# Altium schematic sheet MRAM_MR25H40.SchDoc
size 420 x 297 mm; SheetNumber: 9; SheetTotal: 13
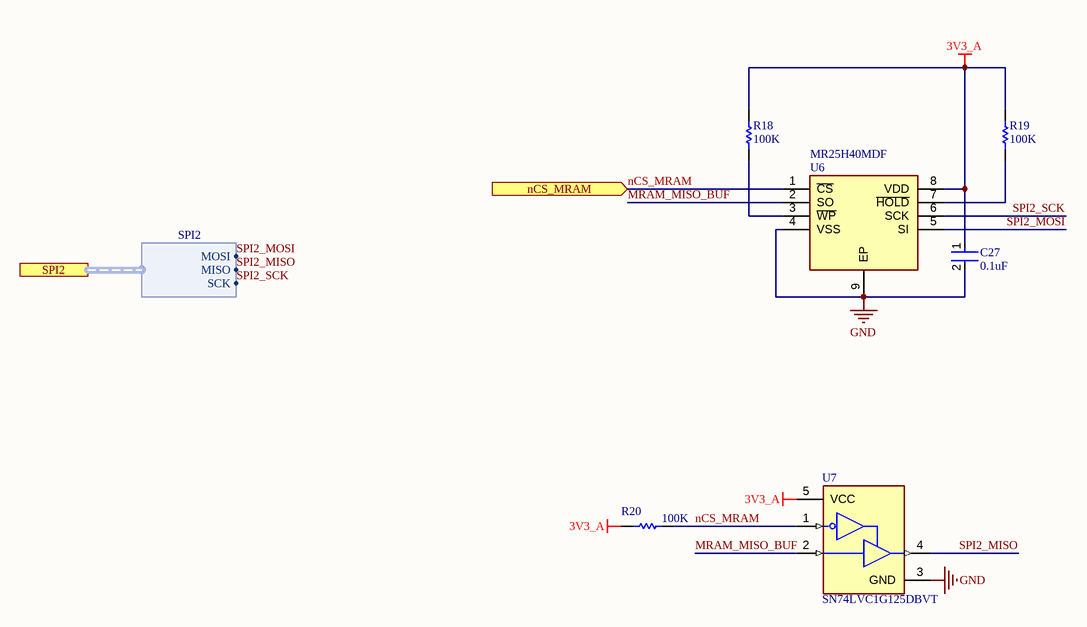
[diagram p0: MRAM_MR25H40.SchDoc]

## Parts
C27  0.1uF  [FP-C0603C-CF-MFG]
R18  100K  [RESC1608X55X30ML20T10]
R19  100K  [RESC1608X55X30ML20T10]
R20  100K  [RESC1608X55X30ML20T10]
U6  MR25H40MDF  [SON127P600X500X90-9N-D]
U7  SN74LVC1G125DBVT  [FP-DBV0005A-MFG]

## Ports
nCS_MRAM (in), SPI2 (harness SPI2)

## Harnesses
SPI2: MOSI, MISO, SCK

## Nets
3V3_A: C27.1 R18.1 R19.1 R20.2 U6.8(VDD) U7.5(VCC)
GND: C27.2 U6.4(VSS) U6.9(EP) U7.3(GND)
MRAM_MISO_BUF: U6.2(SO) U7.2(A)
nCS_MRAM: R20.1 U6.1(~{CS}) U7.1(~{OE}) ; port nCS_MRAM
SPI2_MISO: U7.4(Y) ; port SPI2.MISO
SPI2_MOSI: U6.5(SI) ; port SPI2.MOSI
SPI2_SCK: U6.6(SCK) ; port SPI2.SCK
NetR18_2: R18.2 U6.3(~{WP})
NetR19_2: R19.2 U6.7(~{HOLD})

## Notes on the sheet
- THIS DOCUMENT AND THE DATA DISCLOSED HEREIN OR
- HEREWITH IS THE PROPERTY OF ALTIUM LIMITED AND MAY
- DWG NO:
- REVISION
- REV:
- DESCRIPTION
- DATE
- APPROVED
- BE FREELY DISTRIBUTED IN WHOLE. NO RIGHTS ARE
- RESERVED OR EXPRESS OR IMPLIED WARANTEE GIVEN.
- ENG:
- APPROVALS
- PROJECT
- DSN:
- CHK:
- REFERENCE DOCUMENTS
- PROJECT REVISION:
- TITLE
- DOCUMENT REVISION:
- DESIGN ITEM:
- BOM:
- FAB DWG:
- PCB DWG:
- ASSY DWG:
- SCALE:
- A3
- SIZE
- CAGE CODE
- FILE NAME
- DWG NO.
- SHEET
- OF
- REV

## Library data of the parts
C27 = CMP-2006-03061-2: CAP CER 0.1UF 50V X7R 0603; Manufacturer: KEMET; Manufacturer Part Number: C0603C104K5RACTU; Tolerance: 0.1; Temperature Coefficient: 30ppm/°C; Material: Ceramic; Automotive Grade: Grade 1; Value: 0.10 μF; Temperature: -55°C to +125°C; RoHS: TRUE; Temperature Range High: +125°C; Lead Free: Yes; Octopart: https://octopart.com/c0603c104k5ractu-kemet-139244; Digikey Description: CAP CER 0.1UF 50V X7R 0603; Category: Cap; Package: C0603C-CF; ComponentLink2Description: Datasheet; Temperature Range Low: -55°C; Device Class L1: Passive Components; Voltage Rating: 50 V; Automotive: Yes; Device Class L3: Ceramic Capacitors; ComponentLink2URL: https://api.kemet.com/component-edge/download/datasheet/C0603C100J5GACAUTO.pdf; Capacitance: 0.10 μF; Device Class L2: Capacitors; Temperature Characteristic: X7R; Height: 0.87mm
R18-R20 = CMP-2000-01852-1: Part Number: RK73B1JTTD104J; Manufacturer: KOA Speer
U6 = MR25H40MDF: Integrated Circuit; Manufacturer_Name: Everspin Technologies; Datasheet Link: https://datasheet.datasheetarchive.com/originals/distributors/Datasheets-DGA23/1514724.pdf; Height: 0.9mm; Manufacturer_Part_Number: MR25H40MDF; Mouser Part Number: 936-MR25H40MDF; Mouser Price/Stock: https://www.mouser.co.uk/ProductDetail/Everspin-Technologies/MR25H40MDF?qs=laR3Dyet2Vc5UBOlfE70WA%3D%3D; Arrow Part Number: MR25H40MDF; Arrow Price/Stock: https://www.arrow.com/en/products/mr25h40mdf/everspin-technologies?utm_currency=USD&region=europe
U7 = CMP-0859-00018-4: IC BUF NON-INVERT 5.5V SOT23-5; Manufacturer: Texas Instruments; Min Supply Voltage: 1.65V; Number Of Outputs: 1; Propagation Delay: 4.2ns; Logic Function Desc: Non-Inverting; Nominal Supply Current: 10uA; Standoff Height: 0mm; ComponentLink2Description: Datasheet; Temperature Range High: +125°C; Octopart: https://octopart.com/sn74lvc1g125dbvt-texas+instruments-1006799; Ambient Temperature Range Low: -40°C; Temperature: -40°C to +125°C; Mouser Description: Buffers & Line Drivers SNGL Bus Buffer Gate; Automotive: No; RoHS: TRUE; Device Class L2: Logic ICs; Ambient Temperature Range High: +125°C; ComponentLink2URL: http://www.ti.com/lit/ds/symlink/sn74lvc1g125.pdf; Height: 1.45mm; Number Of Circuits: 1; Device Class L1: Integrated Circuits (ICs); Max Supply Voltage: 5.5V; Manufacturer Part Number: SN74LVC1G125DBVT; Temperature Range Low: -40°C; Package: DBV0005A; Device Class L3: Logic Gates; Number Of Inputs: 1; Lead Free: Yes; Category: IC; Digikey Description: IC BUF NON-INVERT 5.5V SOT23-5